# Altium schematic sheet Alimentation.SchDoc: Circuit d'alimentation
size Letter; ApprovedBy: Kevin Cotton; Author: Jessica Di Stefano; Revision: B; SheetNumber: 6; SheetTotal: 7
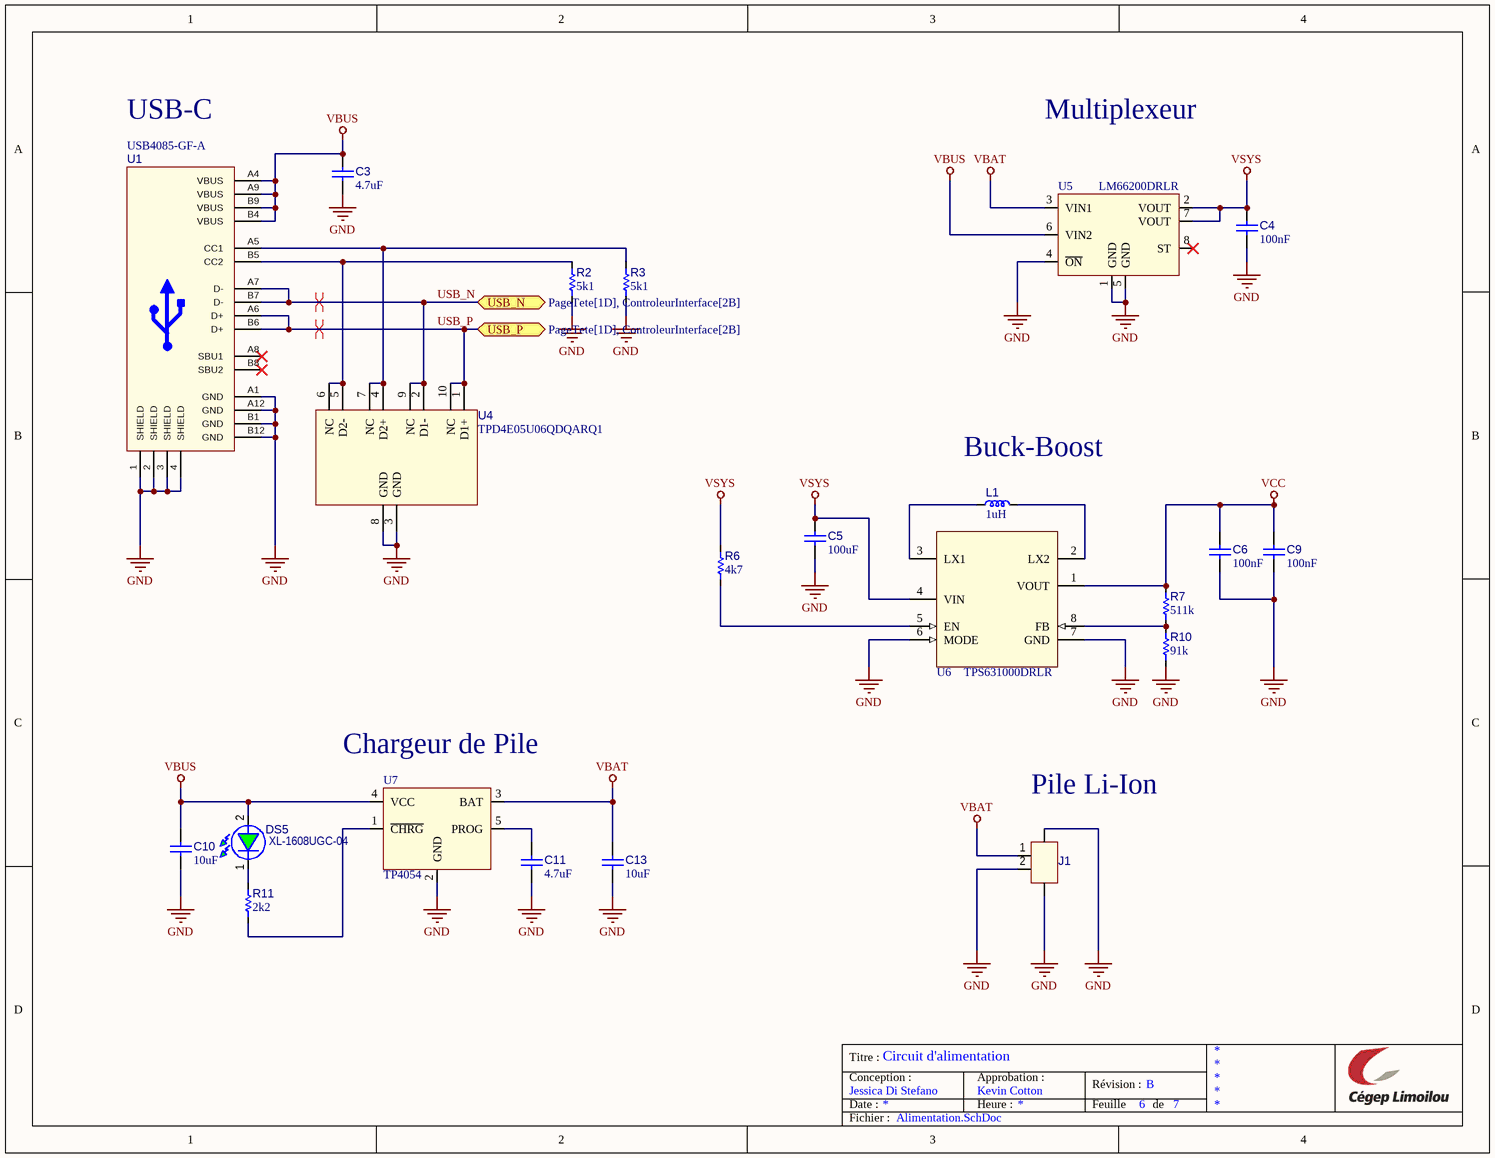
[diagram p0: Alimentation.SchDoc]

## Parts
C3  value 4.7uF  [C_2012[0805]]  (hidden comment: Cap 4.7uF 0805)
C4  value 100nF  [C_1005[0402]]  (hidden comment: Cap 100nF 0402)
C5  value 100uF  [C_3216[1206]]  (hidden comment: Cap 100uF 1206)
C6  value 100nF  [C_1005[0402]]  (hidden comment: Cap 100nF 0402)
C9  value 100nF  [C_1005[0402]]  (hidden comment: Cap 100nF 0402)
C10  value 10uF  [C_2012[0805]]  (hidden comment: Cap 10uF 0805)
C11  value 4.7uF  [C_2012[0805]]  (hidden comment: Cap 4.7uF 0805)
C13  value 10uF  [C_2012[0805]]  (hidden comment: Cap 10uF 0805)
DS5  XL-1608UGC-04  [D_LED_0603]
J1  B2B-PH-SM4-TB  [J_B2B-PH-SM4-TB_JST]  (value not drawn)
L1  value 1uH  [L_3030[1212]]  (hidden comment: Ind 1UH 2.75A 51mOHM SMD)
R2  value 5k1  [R_1005[0402]]  (hidden comment: Res 5k1 1% 0402)
R3  value 5k1  [R_1005[0402]]  (hidden comment: Res 5k1 1% 0402)
R6  value 4k7  [R_1005[0402]]  (hidden comment: Res 4k7 1% 0402)
R7  value 511k  [R_1005[0402]]  (hidden comment: Res 511k 1% 0402)
R10  value 91k  [R_1005[0402]]  (hidden comment: Res 91k 1% 0402)
R11  value 2k2  [R_1005[0402]]  (hidden comment: Res 2k2 1% 0402)
U1  USB4085-GF-A  [FP-USB4085-GF-A-MFG]
U4  TPD4E05U06QDQARQ1  [U_USON50P250X100-10]
U5  LM66200DRLR  [U_SOT583_50P210X120X60-8]
U6  TPS631000DRLR  [U_SOT583_50P210X120X60-8]
U7  TP4054  [U_SOT23-5N(MO-178)]

## Ports
USB_N (bidir, see PageTete[1D], ControleurInterface[2B]), USB_P (bidir, see PageTete[1D], ControleurInterface[2B])

## Nets
GND: C3.1 C4.1 C5.1 C6.2 C9.1 C10.1 C11.1 C13.1 J1.2(Pin_2) J1.S1 J1.S2 R2.1 R3.1 R10.1 U1.1(SHIELD) U1.2(SHIELD) U1.3(SHIELD) U1.4(SHIELD) U1.A1(GND) U1.A12(GND) U1.B1(GND) U1.B12(GND) U4.3(GND) U4.8(GND) U5.1(GND) U5.4(~{ON}) U5.5(GND) U6.6(MODE) U6.7(GND) U7.2(GND)
VBAT: C13.2 J1.1(Pin_1) U5.3(VIN1) U7.3(BAT)
VBUS: C3.2 C10.2 DS5.2(A) U1.A4(VBUS) U1.A9(VBUS) U1.B4(VBUS) U1.B9(VBUS) U5.6(VIN2) U7.4(VCC)
VCC: C6.1 C9.2 R7.2 U6.1(VOUT)
VSYS: C4.2 C5.2 R6.2 U5.2(VOUT) U5.7(VOUT) U6.4(VIN)
USB_N: U1.A7(D-) U1.B7(D-) U4.2(D1-) U4.9(NC) ; port USB_N
USB_P: U1.A6(D+) U1.B6(D+) U4.1(D1+) U4.10(NC) ; port USB_P
NetC11_2: C11.2 U7.5(PROG)
NetDS5_1: DS5.1(K) R11.2
NetL1_1: L1.1 U6.3(LX1)
NetL1_2: L1.2 U6.2(LX2)
NetR2_2: R2.2 U1.B5(CC2) U4.5(D2-) U4.6(NC)
NetR3_2: R3.2 U1.A5(CC1) U4.4(D2+) U4.7(NC)
NetR6_1: R6.1 U6.5(EN)
NetR7_1: R7.1 R10.2 U6.8(FB)
NetR11_1: R11.1 U7.1(~{CHRG})

Not connected (* = marked no-connect by the designer): U1 A8(SBU1)* B8(SBU2)*; U5 8(ST)*

## Layout directives
differential pair: USB_N, USB_P

## Notes on the sheet
- USB-C
- Multiplexeur
- (near L1) Buck-Boost
- (near U7) Chargeur de Pile
- (near J1) Pile Li-Ion
- Titre :
- Conception :
- Date :
- Approbation :
- Heure :
- Révision :
- Feuille
- de
- Fichier :

## Library data of the parts
C3 C11 = CAP003: Capacitor type 1; Manufacturer 1: Taiyo Yuden; Manufacturer Part Number 1: TMK212AB7475KG-T; CEGEP: KCOND02SM; Tolerance: 10%; Rated Voltage: 25V; Dielectric: X7R; LibRef: CAP003; Mount: SMT; Supplier 1: LCSC; Supplier Part Number 1: C163186
C4 C6 C9 = CAP001: Capacitor type 1; Manufacturer 1: Taiyo Yuden; Manufacturer Part Number 1: UMK105B7104KV-FR; CEGEP: KCOND01SM; Tolerance: 10%; Rated Voltage: 50V; Dielectric: X7R; LibRef: CAP001; Mount: SMT; Supplier 1: LCSC; Supplier Part Number 1: C2167491
C5 = CAP005: Capacitor type 1; Manufacturer 1: Murata; Manufacturer Part Number 1: GRM31CR61A107MEA8L; CEGEP: KCOND04SM; Tolerance: 20%; Rated Voltage: 10V; Dielectric: X5R; LibRef: CAP005; Mount: SMT; Supplier 1: LCSC; Supplier Part Number 1: C883598
C10 C13 = CAP004: Capacitor type 1; Manufacturer 1: Samsung; Manufacturer Part Number 1: CL21A106KAYNNNE; CEGEP: KCOND03SM; Tolerance: 10%; Rated Voltage: 25V; Dielectric: X5R; LibRef: CAP004; Mount: SMT; Supplier 1: LCSC; Supplier Part Number 1: C15850
DS5 = D_LED_GREEN_0603: LED Green Clear 40mcd 140deg; Manufacturer 1: XINGLIGHT; CEGEP: KLEDVC0603; Value: Green; Manufacturer 2: Wurth; Manufacturer Part Number 1: XL-1608UGC-04; Manufacturer Part Number 2: 150060VS75000; Mounting Technology: SMT; Supplier 1: LCSC; Supplier 2: Digikey; Supplier Part Number 1: C965804; Supplier Part Number 2: 732-4980-1-ND
J1 = Conn_01x02_B2B-PH-SM4-TB: Conn. 2 pins JST B2B SMT Straight 2mm; Value: Conn_01x02 SMT; CEGEP: KPTSO08; Manufacturer 1: JST; Manufacturer Part Number 1: B2B-PH-SM4-TB; Mounting Technology: SMT; Supplier 1: LCSC; Supplier 2: Mouser; Supplier Part Number 1: C160352; Supplier Part Number 2: 306-B2BPHSM4TBLFSN
L1 = IND001: Inductor type 1; Manufacturer 1: Murata Electronics; Manufacturer Part Number 1: LQH3NPN1R0MMEL; CEGEP: KPTSO09; Tolerance: 0,2; DCR: 0.025R; Saturation Current: 2.3A; LibRef: IND001; Mount: SMT; Supplier 1: LCSC; Supplier Part Number 1: C703777
R2 R3 = RES010: Resistor type 1; Manufacturer 1: Panasonic; Manufacturer Part Number 1: ERJ-2RKF5101X; Puissance: 1/16W; Max Working Voltage: 50V; LibRef: RES010; Tolerance: 1%; Mount: SMT; Supplier 1: LCSC; Supplier Part Number 1: C25905
R6 = RES007: Resistor type 1; Manufacturer 1: Panasonic; Manufacturer Part Number 1: ERJ-2RKF4701X; Puissance: 1/16W; Max Working Voltage: 50V; LibRef: RES007; Tolerance: 1%; Mount: SMT; Supplier 1: LCSC; Supplier Part Number 1: C400631
R7 = RES012: Resistor type 1; Manufacturer 1: Panasonic; Manufacturer Part Number 1: ERJ-2RKF5113X; Puissance: 1/16W; Max Working Voltage: 50V; LibRef: RES012; Tolerance: 1%; Mounting Technology: SMT; Supplier 1: LCSC; Supplier Part Number 1: C441727
R10 = RES011: Resistor type 1; Manufacturer 1: Panasonic; Manufacturer Part Number 1: ERJ-2RKF9102X; Puissance: 1/16W; Max Working Voltage: 50V; LibRef: RES011; Tolerance: 1%; Mount: SMT; Supplier 1: LCSC; Supplier Part Number 1: C413106
R11 = RES008: Resistor type 1; Manufacturer 1: Yageo; Manufacturer Part Number 1: RC0402FR-072K2L; Puissance: 1/16W; Max Working Voltage: 50V; LibRef: RES008; Tolerance: 1%; Mount: SMT; Supplier 1: LCSC; Supplier Part Number 1: C114762; Supplier 2: Digi-Key; Supplier Part Number 2: 311-2.20KLRCT-ND
U1 = Conn_USB-C_16pos: CONN RCPT USB2.0 TYPE C RA - TH; Manufacturer 1: Global Connector Technology; Manufacturer Part Number 1: USB4085-GF-A; Mounting Technology: TH; Supplier 1: LCSC; Supplier 2: Digikey; Supplier Part Number 1: C7095263; Supplier Part Number 2: 2073-USB4085-GF-ACT-ND
U4 = U_TPD4E05U06: TVS DIODE 5.5V 14V 10USON; Manufacturer 1: Texas Instruments; Manufacturer 2: ElecSuper; Manufacturer Part Number 2: TPD4E05U06QDQARQ1-ES; Manufacturer Part Number 1: TPD4E05U06QDQARQ1; Mounting Technology: SMT; Supplier 1: LCSC; Supplier 2: Digikey; Supplier Part Number 1: C81353; Supplier Part Number 2: 296-40696-1-ND
U5 = U_LM66200DRLR: ORing Controller N-Channel 2:1 SOT-583; Manufacturer 1: Texas Instruments; CEGEP: KPTSO05; Manufacturer Part Number 1: LM66200DRLR; Supplier 1: LCSC; Supplier 2: Digikey; Supplier Part Number 1: C3235556; Supplier Part Number 2: 296-LM66200DRLRCT-ND; Mounting Technology: SMT
U6 = U_TPS631000DRLR: buck-boost converter 1.5-A output current,; Manufacturer 1: Texas Instruments; CEGEP: KPTSO09; Manufacturer Part Number 1: TPS631000DRLR; Supplier 1: LCSC; Supplier 2: Digikey; Supplier Part Number 1: C5219190; Supplier Part Number 2: 296-TPS631000DRLRCT-ND; Mounting Technology: SMT
U7 = U_TP4054: Battery charger Li-ion Linear 1-cell; Manufacturer 1: HXY MOSFET; CEGEP: KPTSO06; Manufacturer 2: Suntek; Manufacturer Part Number 2: SK4054S5-42; Manufacturer Part Number 1: TP4054; Supplier 1: LCSC; Supplier 2: Digikey; Supplier Part Number 1: C668215; Supplier Part Number 2: 4518-TP4054CT-ND; Mounting Technology: SMT